# EasyEDA Pro project ProPrj_Space Mouse_2026-04-12.epro

# Schematic sensor_board
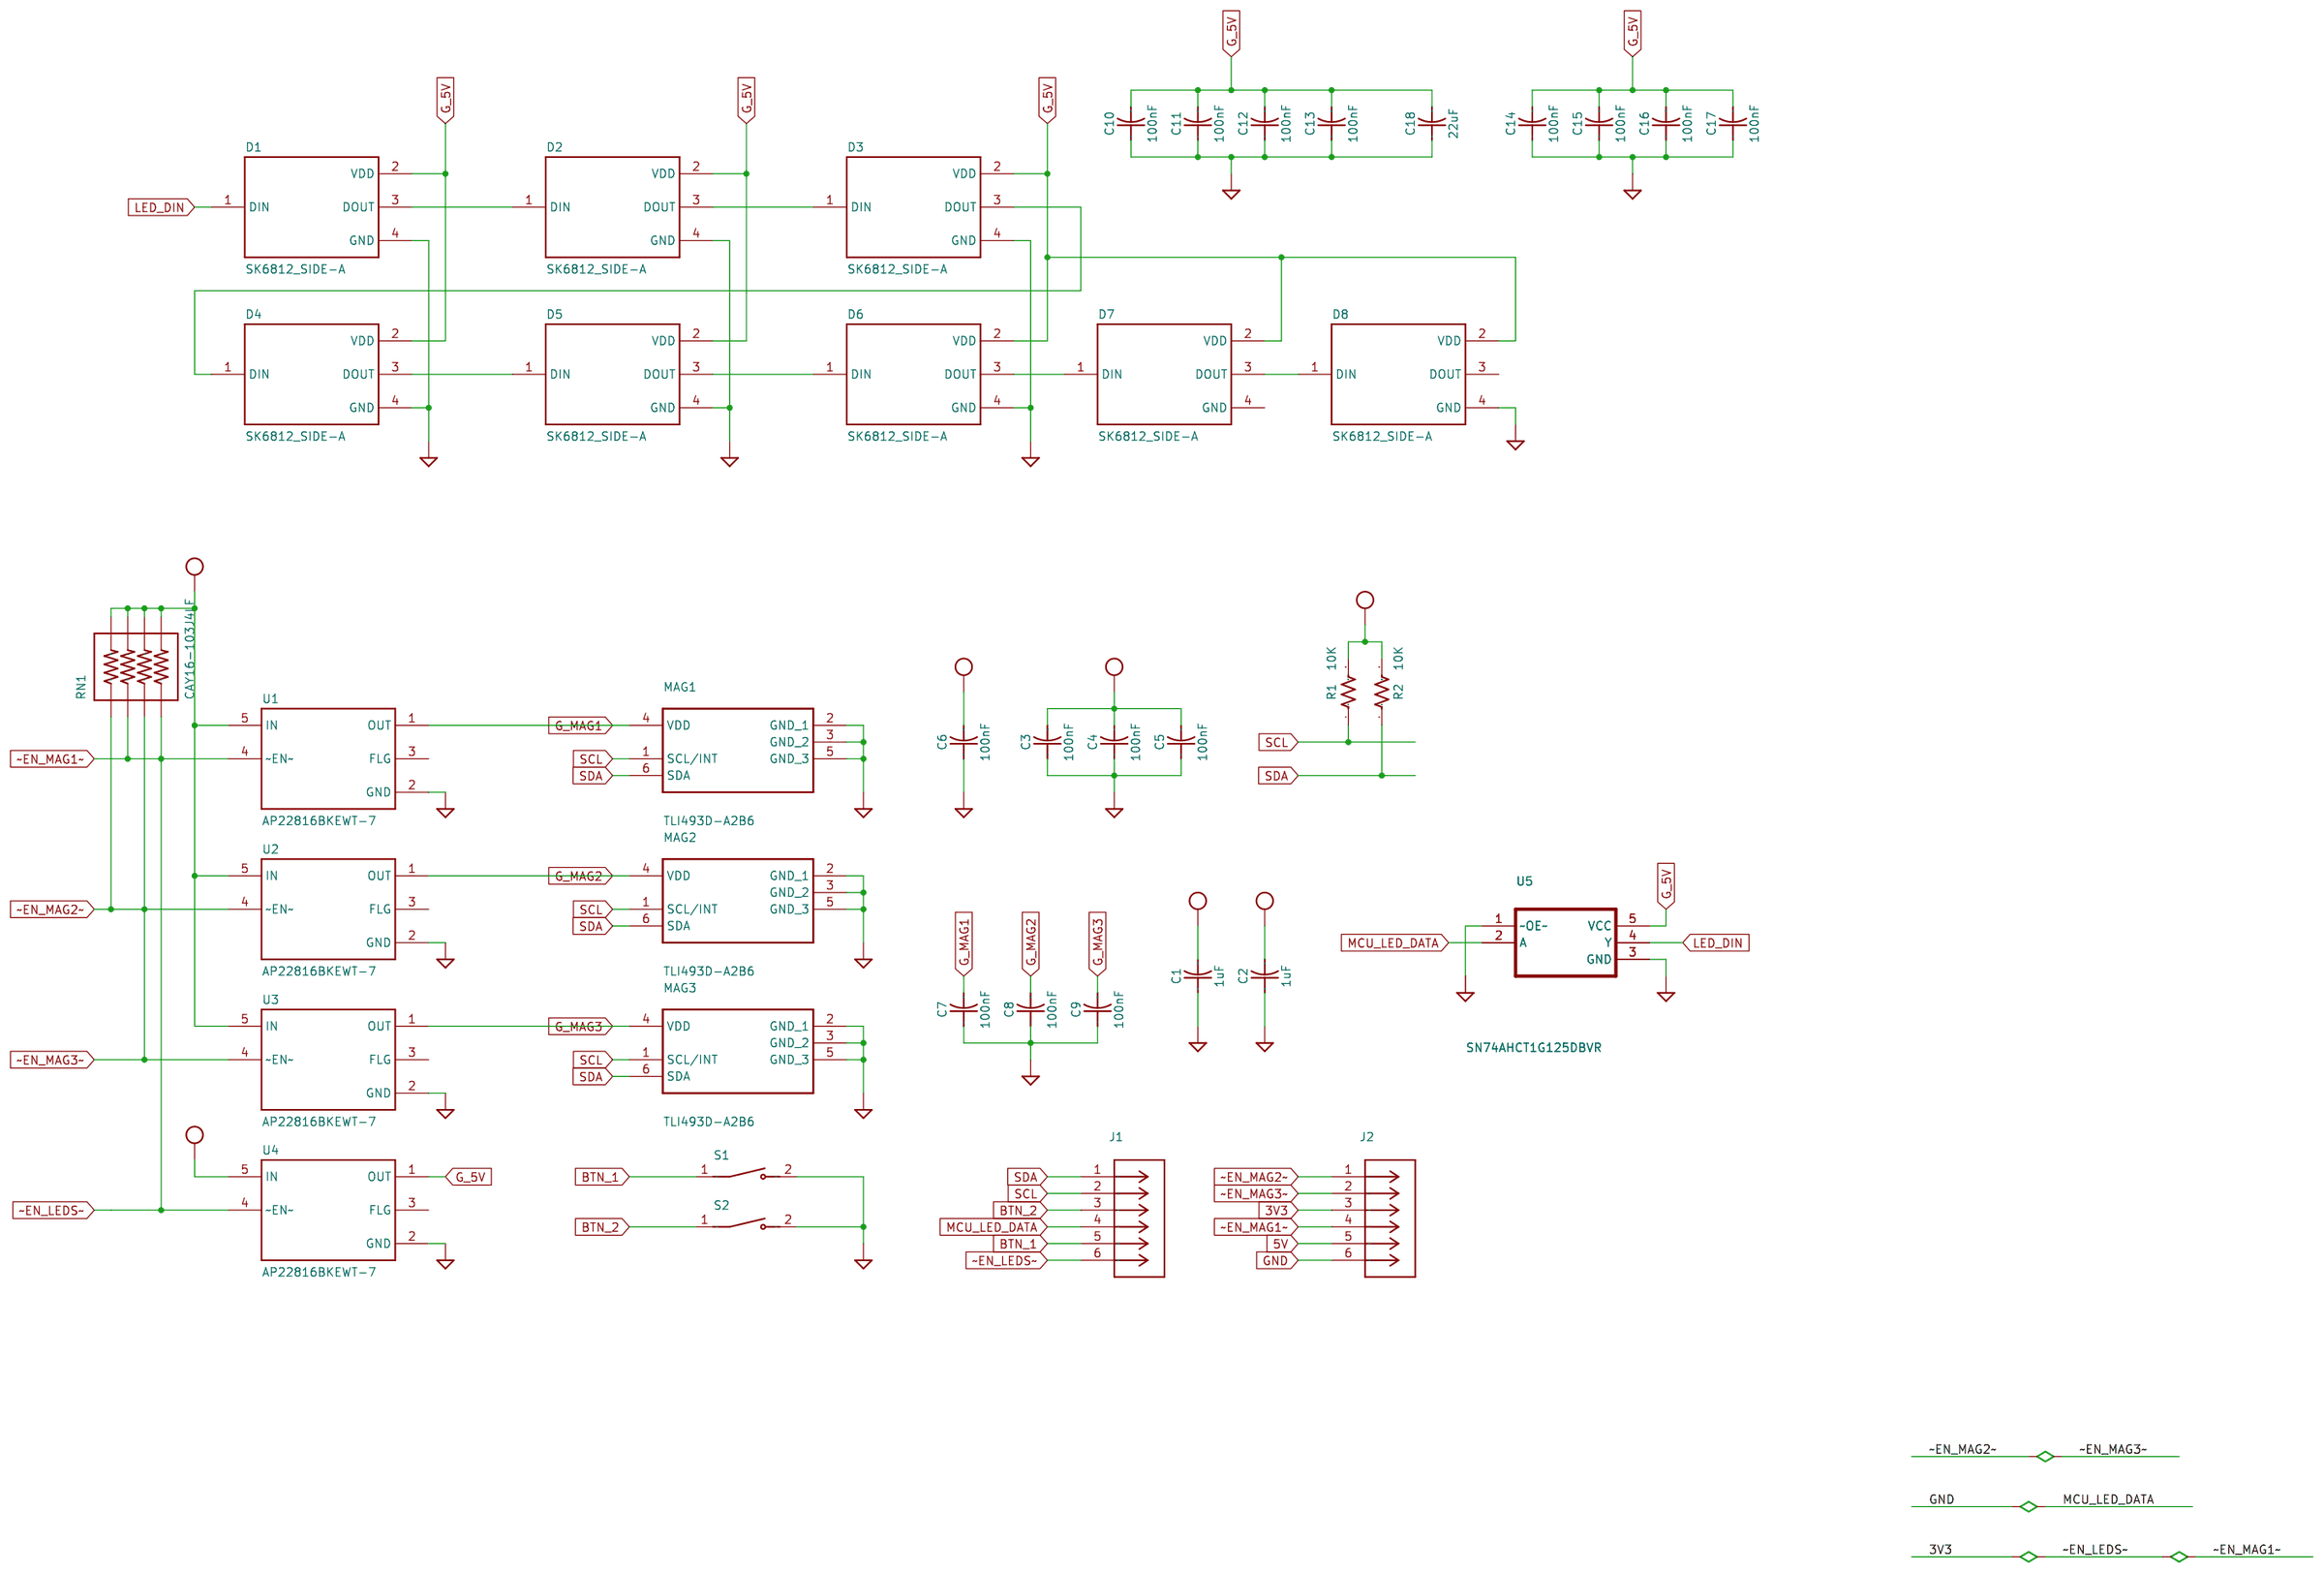
[diagram p0: schematic sheet]

## Parts
C1  1uF
C2  1uF
C3  100nF
C4  100nF
C5  100nF
C6  100nF
C7  100nF
C8  100nF
C9  100nF
C10  100nF
C11  100nF
C12  100nF
C13  100nF
C14  100nF
C15  100nF
C16  100nF
C17  100nF
C18  22uF
D1  SK6812_SIDE-A
D2  SK6812_SIDE-A
D3  SK6812_SIDE-A
D4  SK6812_SIDE-A
D5  SK6812_SIDE-A
D6  SK6812_SIDE-A
D7  SK6812_SIDE-A
D8  SK6812_SIDE-A
J1  NPPN032AFCN-RCCONN3X2_NPPN032AFCN-RC_SUL
J2  NPPN032AFCN-RCCONN3X2_NPPN032AFCN-RC_SUL
MAG1  TLI493D-A2B6
MAG2  TLI493D-A2B6
MAG3  TLI493D-A2B6
R1  10K
R2  10K
RN1  CAY16-103J4LF
S1  TS32-7-35-BK-160-RA-SMT-TR
S2  TS32-7-35-BK-160-RA-SMT-TR
U1  AP22816BKEWT-7
U2  AP22816BKEWT-7
U3  AP22816BKEWT-7
U4  AP22816BKEWT-7
U5  SN74AHCT1G125DBVR

## Library data of the parts
C1 C2 C18 = Capacitor_C-US_CHIP-1206(3216-METRIC)
C3-C17 = Capacitor_C-US_CHIP-0805(2012-METRIC)
D1-D8 = SK6812_SIDE-A_SK6812_SIDE-A_
J1 J2 = NPPN032AFCN-RC_NPPN032AFCN-RC_CONN3X2_NPPN032AFCN-RC_SUL
MAG1-MAG3 = TLI493D-A2B6_TLI493D-A2B6_
R1 R2 = Resistor_R-US_CHIP-0805(2012-METRIC)
RN1 = CAY16-103J4LF_CAY16-103J4LF_
S1 S2 = TS32-7-35-BK-160-RA-SMT-TR_TS32-7-35-BK-160-RA-SMT-TR_
U1-U4 = AP22816BKEWT-7_AP22816BKEWT-7_
U5 = SN74AHCT1G125DBVR_SN74AHCT1G125DBVR_

## Nets
3V3: C1.2 C3.2 C4.2 C5.2 J1.6 J2.3 J2.4 R1.2 R2.2 RN1.2 RN1.4 RN1.5 RN1.6 RN1.7 RN1.8 U1.4(~EN~) U1.5(IN) U2.5(IN) U3.5(IN) U4.4(~EN~)
5V: C2.2 C6.2 J2.5 U4.5(IN)
GND: C1.1 C2.1 C3.1 C4.1 C5.1 C6.1 C7.1 C8.1 C9.1 C10.1 C11.1 C12.1 C13.1 C14.1 C15.1 C16.1 C17.1 C18.1 D1.4(GND) D2.4(GND) D3.4(GND) D4.4(GND) D5.4(GND) D6.4(GND) D8.4(GND) J1.4 J2.6 MAG1.2(GND_1) MAG1.3(GND_2) MAG1.5(GND_3) MAG2.2(GND_1) MAG2.3(GND_2) MAG2.5(GND_3) MAG3.2(GND_1) MAG3.3(GND_2) MAG3.5(GND_3) S1.2 S2.2 U1.2(GND) U2.2(GND) U3.2(GND) U4.2(GND) U5.1(~OE~) U5.2(A) U5.3(GND)
BTN_1: J1.5 S1.1
BTN_2: J1.3 S2.1
G_5V: C10.2 C11.2 C12.2 C13.2 C14.2 C15.2 C16.2 C17.2 C18.2 D1.2(VDD) D2.2(VDD) D3.2(VDD) D4.2(VDD) D5.2(VDD) D6.2(VDD) D7.2(VDD) D8.2(VDD) U4.1(OUT) U5.5(VCC)
G_MAG1: C7.2 MAG1.4(VDD) U1.1(OUT)
G_MAG2: C8.2 MAG2.4(VDD) U2.1(OUT)
G_MAG3: C9.2 MAG3.4(VDD) U3.1(OUT)
LED_DIN: D1.1(DIN) U5.4(Y)
N$1: D1.3(DOUT) D2.1(DIN)
N$2: D2.3(DOUT) D3.1(DIN)
N$3: D6.3(DOUT) D7.1(DIN)
N$4: D3.3(DOUT) D4.1(DIN)
N$5: D4.3(DOUT) D5.1(DIN)
N$6: D5.3(DOUT) D6.1(DIN)
N$7: D7.3(DOUT) D8.1(DIN)
SCL: J1.2 MAG1.1(SCL/INT) MAG2.1(SCL/INT) MAG3.1(SCL/INT) R1.1
SDA: J1.1 MAG1.6(SDA) MAG2.6(SDA) MAG3.6(SDA) R2.1
~EN_MAG2~: J2.1 J2.2 RN1.1 RN1.3 U2.4(~EN~) U3.4(~EN~)

Not connected (* = marked no-connect by the designer): D7 4(GND); D8 3(DOUT); U1 3(FLG); U2 3(FLG); U3 3(FLG); U4 3(FLG)

# Board sensor_board
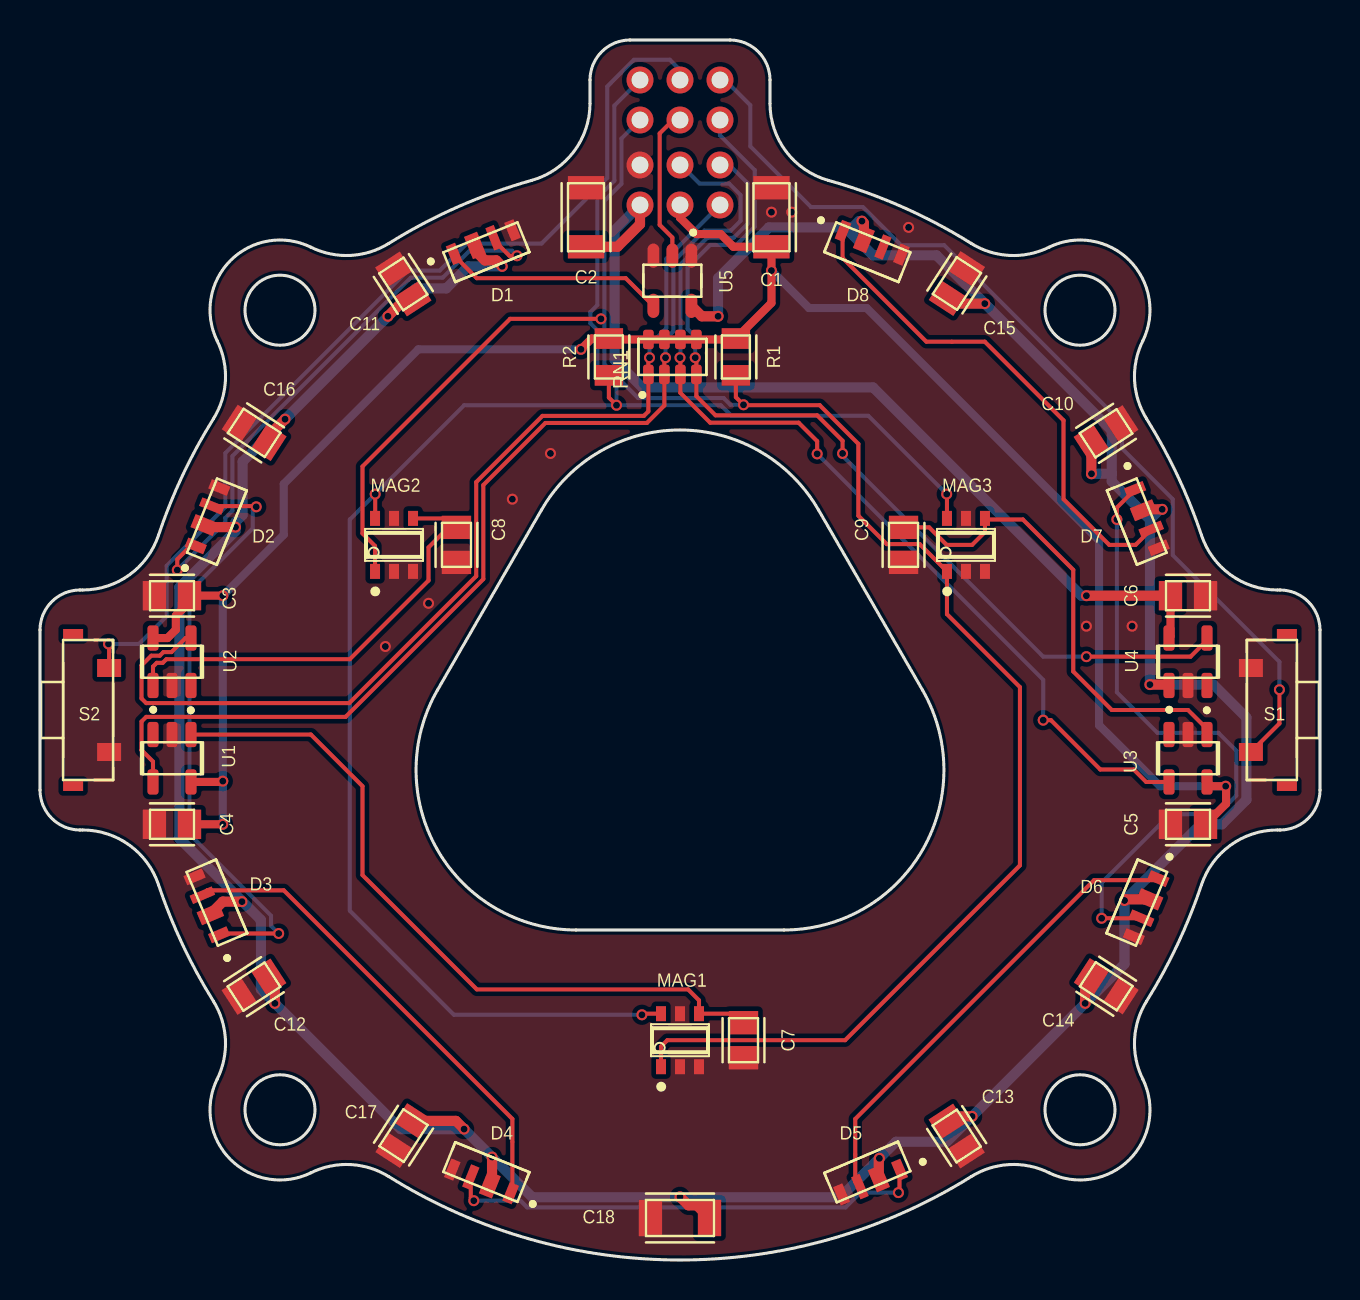
[diagram p1: board, top side]
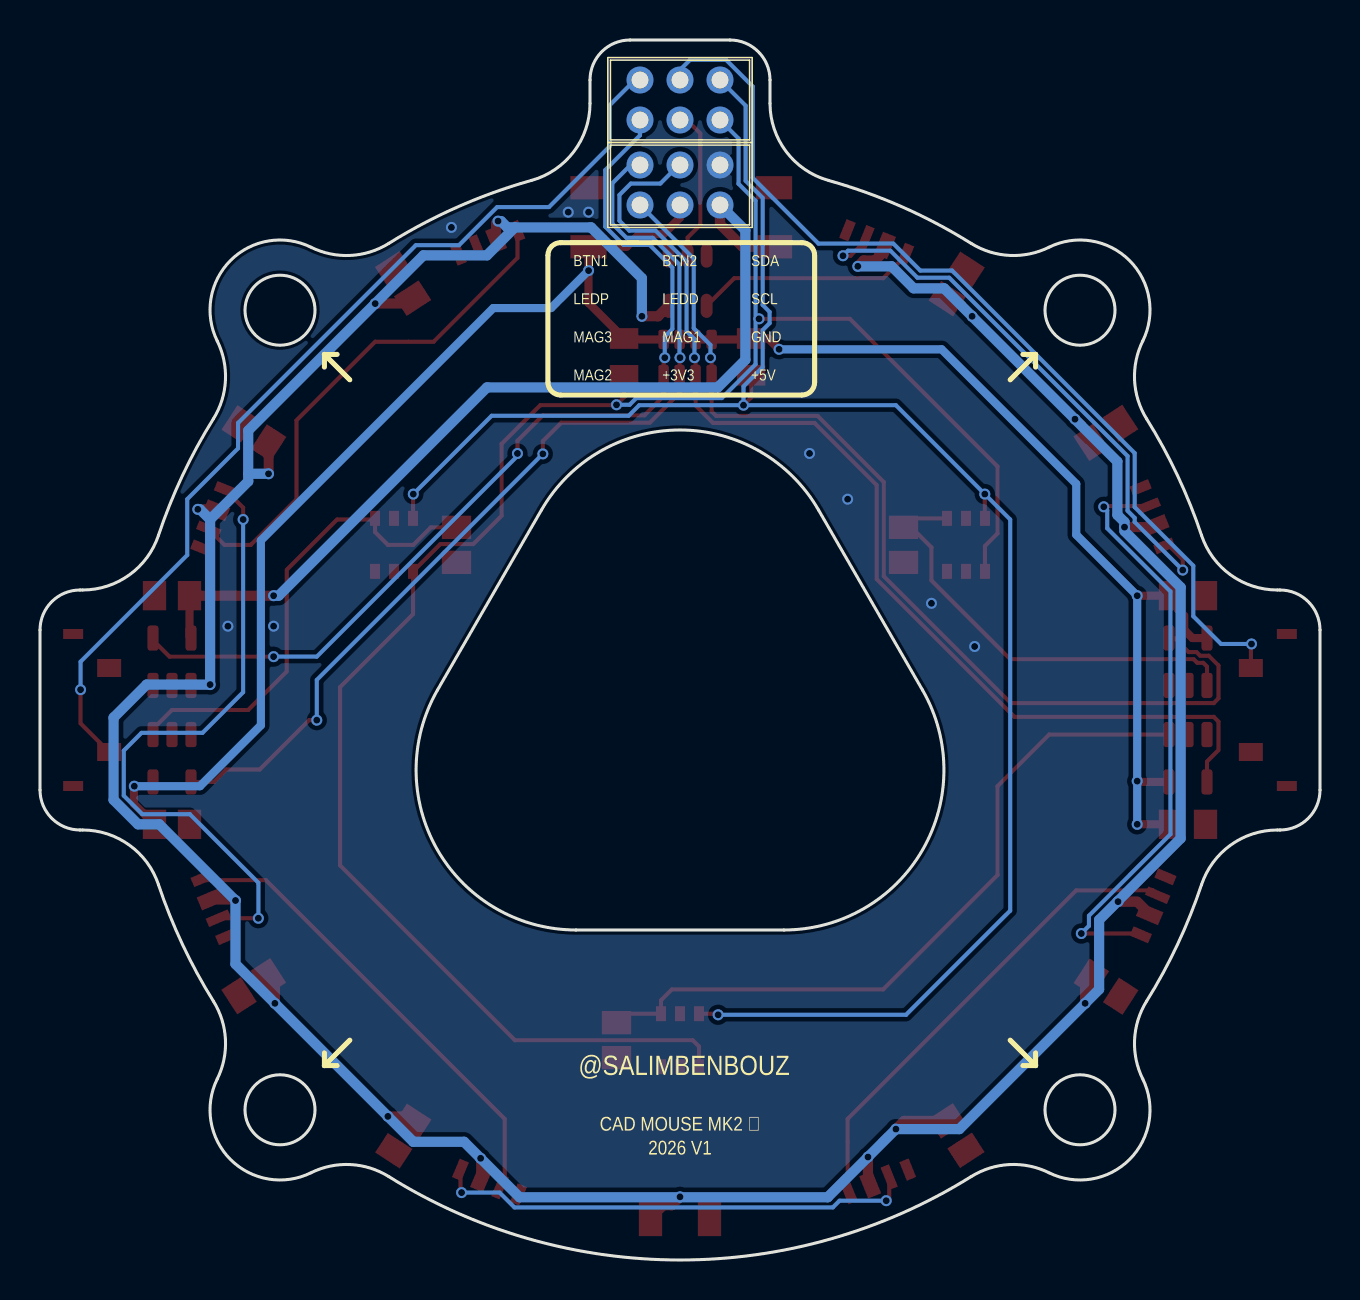
[diagram p2: board, bottom side, seen from below]

Outline 64 x 61 mm; copper layers: Top Layer, Bottom Layer. Coordinates in mm from the lower left corner of the outline.
Outline path: circle c12,47.49 r1.75 ; circle c12,7.51 r1.75 ; circle c52,47.49 r1.75 ; circle c52,7.51 r1.75 ; 0,31.5 arc(0.59,32.91) 2,33.5 2.13,33.5 arc(4.47,34.25) 5.92,36.23 arc(7.12,39.23) 8.67,42.06 arc(9.27,43.98) 8.86,45.95 arc(9.53,49.97) 13.55,50.64 arc(15.52,50.23) 17.44,50.83 arc(20.9,52.66) 24.58,53.98 arc(26.69,55.41) 27.5,57.83 27.5,59 arc(28.09,60.41) 29.5,61 34.5,61 arc(35.91,60.41) 36.5,59 36.5,57.83 arc(37.31,55.41) 39.42,53.98 arc(43.1,52.66) 46.56,50.83 arc(48.48,50.23) 50.45,50.64 arc(54.47,49.97) 55.14,45.95 arc(54.73,43.98) 55.33,42.06 arc(56.88,39.23) 58.08,36.23 arc(59.53,34.25) 61.87,33.5 62,33.5 arc(63.41,32.91) 64,31.5 64,23.5 arc(63.41,22.09) 62,21.5 61.87,21.5 arc(59.53,20.75) 58.08,18.77 arc(56.88,15.77) 55.33,12.94 arc(54.73,11.02) 55.14,9.05 arc(54.47,5.03) 50.45,4.36 arc(48.48,4.77) 46.56,4.17 arc(32,0) 17.44,4.17 arc(15.52,4.77) 13.55,4.36 arc(9.53,5.03) 8.86,9.05 arc(9.27,11.02) 8.67,12.94 arc(7.12,15.77) 5.92,18.77 arc(4.47,20.75) 2.13,21.5 2,21.5 arc(0.59,22.09) 0,23.5 0,31.5 ; 19.88,28.5 25.07,37.5 arc(32,41.5) 38.93,37.5 44.12,28.5 arc(44.12,20.5) 37.2,16.5 26.8,16.5 arc(19.88,20.5) 19.88,28.5
Stack: Top Layer 0.035mm / Dielectric1 1.51mm FR4 er 4.5 / Bottom Layer 0.035mm

## Design rules (mm)
spacing safeClearance (default): track to track 0.152, other pairs 0 to 0.3
track width trackWidth: min 0.152, default 0.152, max 2.54
track width default (default): min 0.003, default 0.003, max 2.54
differential pair differentialPair (default): width min 0.127, default 0.254, max 2.54; gap min 0.152, default 0.152
via viaSize: diameter min 0.3, default 0.3, max 2.6; hole min 0.3, default 0.3, max 2
via default (default): diameter min 0, default 0, max 2.6; hole min 0, default 0, max 2
net GND uses CopperRegion1
pour ie1 uses CopperRegion
pour ie2 uses CopperRegion1

## Placement (name value [footprint] x y rotation side)
C1  1uF  [CAPC3216X135]  36.57 52.14 270 top
C2  1uF  [CAPC3216X135]  27.3 52.14 270 top
C3  100nF  [CAPC2012X110]  6.6 33.22 0 top
C4  100nF  [CAPC2012X110]  6.6 21.79 0 top
C5  100nF  [CAPC2012X110]  57.4 21.79 0 top
C6  100nF  [CAPC2012X110]  57.4 33.22 180 top
C7  100nF  [CAPC2012X110]  35.18 10.99 90 top
C8  100nF  [CAPC2012X110]  20.82 35.76 90 top
C9  100nF  [CAPC2012X110]  43.18 35.76 90 top
C10  100nF  [CAPC2012X110]  53.3 41.33 213 top
C11  100nF  [CAPC2012X110]  18.17 48.8 303 top
C12  100nF  [CAPC2012X110]  10.7 13.67 33 top
C13  100nF  [CAPC2012X110]  45.83 6.2 123 top
C14  100nF  [CAPC2012X110]  53.31 13.69 147 top
C15  100nF  [CAPC2012X110]  45.84 48.82 237 top
C16  100nF  [CAPC2012X110]  10.71 41.36 327 top
C17  100nF  [CAPC2012X110]  18.18 6.22 57 top
C18  22uF  [CAPC3216X135]  32 2.1 0 top
D1  SK6812_SIDE-A  [LED_SK6812_SIDE-A]  22.32 50.39 22 top
D2  SK6812_SIDE-A  [LED_SK6812_SIDE-A]  8.84 36.92 68 top
D3  SK6812_SIDE-A  [LED_SK6812_SIDE-A]  8.84 17.87 113 top
D4  SK6812_SIDE-A  [LED_SK6812_SIDE-A]  22.32 4.4 158 top
D5  SK6812_SIDE-A  [LED_SK6812_SIDE-A]  41.37 4.4 203 top
D6  SK6812_SIDE-A  [LED_SK6812_SIDE-A]  54.84 17.87 247 top
D7  SK6812_SIDE-A  [LED_SK6812_SIDE-A]  54.84 36.92 292 top
D8  SK6812_SIDE-A  [LED_SK6812_SIDE-A]  41.37 50.39 338 top
J1  NPPN032AFCN-RCCONN3X2_NPPN032AFCN-RC_SUL  [CONN3X2_NPPN032AFCN-RC_SUL]  32 58 180 bottom
J2  NPPN032AFCN-RCCONN3X2_NPPN032AFCN-RC_SUL  [CONN3X2_NPPN032AFCN-RC_SUL]  32 53.75 0 bottom
MAG1  TLI493D-A2B6  [SOP95P280X110-6N-V]  32 10.99 90 top
MAG2  TLI493D-A2B6  [SOP95P280X110-6N-V]  17.7 35.76 90 top
MAG3  TLI493D-A2B6  [SOP95P280X110-6N-V]  46.3 35.76 90 top
R1  10K  [RESC2012X65]  34.79 45.15 90 top
R2  10K  [RESC2012X65]  28.44 45.15 90 top
RN1  CAY16-103J4LF  [RESCAF80P320X160X60-8N]  31.62 45.15 90 top
S1  TS32-7-35-BK-160-RA-SMT-TR  [SW_TS32-7-35-BK-160-RA-SMT-TR]  61.84 27.5 90 top
S2  TS32-7-35-BK-160-RA-SMT-TR  [SW_TS32-7-35-BK-160-RA-SMT-TR]  2.16 27.5 270 top
U1  AP22816BKEWT-7  [SOT95P280X100-5N]  6.6 25.09 270 top
U2  AP22816BKEWT-7  [SOT95P280X100-5N]  6.6 29.91 90 top
U3  AP22816BKEWT-7  [SOT95P280X100-5N]  57.4 25.09 270 top
U4  AP22816BKEWT-7  [SOT95P280X100-5N]  57.4 29.91 90 top
U5  SN74AHCT1G125DBVR  [SOT95P280X145-5N]  31.62 48.96 270 top

## Footprints (pads in the part's own frame, mm; a bottom-side part is the same pattern mirrored in y, then rotated)
CAPC2012X110
  rect 1.165x1.466 smd: 1(-0.875,0) 2(0.875,0)
CAPC3216X135
  rect 1.165x1.815 smd: 1(-1.476,0) 2(1.476,0)
CONN3X2_NPPN032AFCN-RC_SUL
  round 1.346 hole 0.838: 1(2,1) 2(2,-1) 3(0,1) 4(0,-1) 5(-2,1) 6(-2,-1)
LED_SK6812_SIDE-A
  rect 0.5x1 smd: 1(-1.525,0.525) 4(1.625,0.525)
  rect 0.7x1.2 smd: 2(-0.4,0.525)
  rect 0.45x1.2 smd: 3(0.625,0.525)
RESC2012X65
  rect 1.031x1.42 smd: 1(-0.919,0) 2(0.919,0)
RESCAF80P320X160X60-8N
  rrect 0.97x0.53 smd: 1(-0.875,1.2) 2(-0.875,0.4) 3(-0.875,-0.4) 4(-0.875,-1.2) 5(0.875,-1.2) 6(0.875,-0.4) 7(0.875,0.4) 8(0.875,1.2)
SOP95P280X110-6N-V
  rect 0.75x0.5 smd: 1(-1.325,0.95) 2(-1.325,0) 3(-1.325,-0.95) 4(1.325,-0.95) 5(1.325,0) 6(1.325,0.95)
SOT95P280X100-5N
  rrect 1.26x0.55 smd: 1(-1.185,0.95) 2(-1.185,0) 3(-1.185,-0.95) 4(1.185,-0.95) 5(1.185,0.95)
SOT95P280X145-5N
  rrect 1.21x0.59 smd: 1(-1.255,0.95) 2(-1.255,0) 3(-1.255,-0.95) 4(1.255,-0.95) 5(1.255,0.95)
SW_TS32-7-35-BK-160-RA-SMT-TR
  rect 0.9x1.2 smd: 1(-2.1,1.3) 2(2.1,1.3)
  rect 0.5x1 smd: SH1(-3.8,-0.5) SH2(3.8,-0.5)

## Nets
3V3: C1.2 C3.2 C4.2 C5.2 J2.3 R1.2 R2.2 RN1.5 RN1.6 RN1.7 RN1.8 U1.5 U2.5 U3.5
5V: C2.2 C6.2 J2.5 U4.5
GND: C1.1 C2.1 C3.1 C4.1 C5.1 C6.1 C7.1 C8.1 C9.1 C10.1 C11.1 C12.1 C13.1 C14.1 C15.1 C16.1 C17.1 C18.1 D1.4 D2.4 D3.4 D4.4 D5.4 D6.4 D7.4 D8.4 J2.6 MAG1.2 MAG1.3 MAG1.5 MAG2.2 MAG2.3 MAG2.5 MAG3.2 MAG3.3 MAG3.5 S1.2 S2.2 U1.2 U2.2 U3.2 U4.2 U5.1 U5.3
!EN_LEDS: J1.6 RN1.4 U4.4
!EN_MAG1: J2.4 RN1.2 U1.4
!EN_MAG2: J2.1 RN1.1 U2.4
!EN_MAG3: J2.2 RN1.3 U3.4
BTN_1: J1.5 S1.1
BTN_2: J1.3 S2.1
G_5V: C10.2 C11.2 C12.2 C13.2 C14.2 C15.2 C16.2 C17.2 C18.2 D1.2 D2.2 D3.2 D4.2 D5.2 D6.2 D7.2 D8.2 U4.1 U5.5
G_MAG1: C7.2 MAG1.4 U1.1
G_MAG2: C8.2 MAG2.4 U2.1
G_MAG3: C9.2 MAG3.4 U3.1
LED_DIN: D1.1 U5.4
MCU_LED_DATA: J1.4 U5.2
N$1: D1.3 D2.1
N$2: D2.3 D3.1
N$3: D6.3 D7.1
N$4: D3.3 D4.1
N$5: D4.3 D5.1
N$6: D5.3 D6.1
N$7: D7.3 D8.1
SCL: J1.2 MAG1.1 MAG2.1 MAG3.1 R1.1
SDA: J1.1 MAG1.6 MAG2.6 MAG3.6 R2.1

Pads without a net: D8 3; S1 SH1 SH2; S2 SH1 SH2; U1 3; U2 3; U3 3; U4 3

## Via types
v1: diameter 0.55, hole 0.35, Top Layer to Bottom Layer, 59 vias

## Routing (per net, layer and track width the routed paths; a pad name or vN(x,y) marks a point on that pad's centre or on a via; arc(x,y) is an arc through that point)
3V3: length 105.5
  Top Layer w0.406: J2.3 32,52.12 32.82,51.3 34.03,51.3 34.67,50.66 C1.2 v1(36.57,49.47) 36.57,47.85 R1.2 34.75,46.03 RN1.5 RN1.6 RN1.7 RN1.8 28.49,46.03 R2.2 27.59,46.07 v1(27.05,45.53) ; 59.31,23.69 58.56,23.69 U3.5 ; 59.31,23.69 59.31,22.81 C5.2 ; 59.31,23.69 v1(59.28,23.69) ; U2.5 6.38,31.1 6.79,31.51 6.79,32.22 7.09,32.52 7.09,32.83 C3.2 v1(9.14,33.22) ; U1.5 9.1,23.9 v1(9.14,23.94) ; v1(9.14,21.79) C4.2
  Bottom Layer w0.406: v1(27.05,45.53) 18.92,45.53 12.19,38.8 12.19,36.26 v1(9.14,33.22) v1(9.14,23.94) v1(9.14,21.79) ; v1(36.57,49.47) 38.45,47.6 41.33,47.6 52.96,35.98 52.96,26.74 56,23.69 v1(59.28,23.69)
5V: length 47.2
  Top Layer w0.406: C6.2 56.52,31.17 U4.5
  Top Layer w0.508: C2.2 28.87,50.66 30,51.79 J2.5 ; C6.2 v1(52.32,33.22)
  Bottom Layer w0.508: J2.5 28.73,51.48 28.73,45.01 30.11,43.63 41.65,43.63 52.07,33.22 v1(52.32,33.22)
GND:
  vias: v1(17.27,30.68) v1(19.43,32.83) v1(23.62,38.04) v1(25.52,40.33) v1(36.57,52.39) v1(37.59,52.39) v1(43.43,51.63) v1(52.32,31.69) v1(54.61,31.69)
!EN_LEDS: length 48.7
  Top Layer w0.203: v1(32.76,45.12) 32.82,45.06 RN1.4 32.82,43.19 33.78,42.23 38.86,42.23 40.13,40.96 v1(40.13,40.33) ; U4.4 58.35,30.99 57.53,30.17 v1(52.32,30.17)
  Bottom Layer w0.203: v1(40.13,40.33) 40.13,40.2 50.16,30.17 v1(52.32,30.17) ; v1(32.76,45.12) 32.76,46.17 32.38,46.55 32.38,49.62 33.51,50.76 34.83,50.76 35.74,51.67 35.74,54.49 34,56.23 J1.6
!EN_MAG1: length 55.2
  Top Layer w0.203: U1.4 5.65,24.92 5.08,25.5 5.08,26.92 5.31,27.16 15.28,27.16 22.17,34.05 22.17,38.75 25.27,41.85 30.34,41.85 31.22,42.73 RN1.2 31.22,45.06 v1(31.28,45.12)
  Bottom Layer w0.203: v1(31.28,45.12) 31.28,46.05 31.67,46.44 31.67,49.92 33.22,51.47 34.53,51.47 35.03,51.96 35.03,53.25 34.46,53.82 32.98,53.82 32.05,54.75 J2.4
!EN_MAG2: length 50.7
  Top Layer w0.203: v1(30.48,45.12) 30.42,45.06 RN1.1 30.42,42.43 30.2,42.21 25.12,42.21 21.81,38.9 21.81,34.19 15.46,27.84 5.31,27.84 5.08,28.08 5.08,29.73 5.56,30.21 5.99,30.21 6.17,30.4 6.57,30.4 7.28,31.1 U2.4
  Bottom Layer w0.203: J2.1 31.31,50.07 31.31,46.59 30.48,45.75 v1(30.48,45.12)
!EN_MAG3: length 48.5
  Top Layer w0.203: v1(32,45.12) 32.02,45.1 RN1.3 32.02,43.36 33.51,41.86 37.93,41.86 38.86,40.94 v1(38.86,40.31) ; U3.4 55.31,23.9 54.68,24.52 53.01,24.52 50.55,26.99 v1(50.16,26.99)
  Bottom Layer w0.203: v1(38.86,40.31) 50.16,29 v1(50.16,26.99) ; J2.2 34.47,54.75 35.38,53.83 35.38,51.82 34.68,51.11 33.37,51.11 32.03,49.77 32.03,45.27 32,45.24 v1(32,45.12)
BTN_1: length 48.7
  Top Layer w0.203: v1(61.97,28.52) 61.97,26.83 S1.1
  Bottom Layer w0.203: J1.5 34.25,59 35.51,57.74 35.51,55.69 38.55,52.65 41.14,52.65 43.05,50.74 45.21,50.74 54.1,41.85 54.1,40.58 56.64,38.04 56.64,35.25 61.97,29.91 v1(61.97,28.52)
BTN_2: length 48.3
  Top Layer w0.203: S2.1 3.45,30.77 v1(3.42,30.8)
  Bottom Layer w0.203: v1(3.42,30.8) 4.95,30.8 6.34,32.19 6.34,34.71 9.27,37.65 9.27,40.35 18.39,49.47 19.98,49.47 21.33,50.82 25.08,50.82 28.36,54.11 28.36,58.67 29.7,60.01 31.49,60.01 32,59.5 J1.3
G_5V: length 192
  Top Layer w0.508: v1(32,3.16) 32.42,2.74 32.84,2.74 C18.2 ; D5.2 41.94,5.06 v1(41.97,5.08) ; v1(47.24,47.82) 45.64,47.82 C15.2 ; v1(22.6,5.15) 22.6,3.87 22.49,3.76 ; v1(55.5,28.77) 56.41,28.77 U4.1 ; 52.57,40.86 52.57,39.32 v1(52.57,39.31) ; v1(23.11,49.68) 22.81,49.98 22.25,49.98 21.75,50.48 D1.2 ; v1(9.78,36.64) 8.31,36.64 D2.2 ; C16.2 11.44,41.23 v1(12.25,42.04) ; v1(54.22,17.98) 54.28,18.03 D6.2 ; D7.2 55.22,37.53 v1(56.11,37.53) ; 11.43,14.14 11.74,13.83 v1(11.74,12.83) ; v1(46.6,7.18) 45.6,7.18 45.36,6.93 ; C14.2 52.26,13.84 v1(52.26,12.83) ; v1(41.1,51.94) 41.19,51.85 D8.2 ; U5.5 33.09,47.19 v1(33.91,47.19) ; C17.2 20.8,6.95 v1(21.21,6.55) ; v1(10.1,17.92) 9.14,17.92 D3.2 ; 18.64,48.07 18.28,48.07 v1(17.4,47.19)
  Bottom Layer w0.508: 55.5,37.03 56,37.53 v1(56.11,37.53) ; 55.5,37.03 v1(55.5,28.77) 58.67,28.77 60.32,27.12 60.32,23.01 59.1,21.79 58.03,21.79 v1(54.22,17.98) 54.22,14.8 v1(52.26,12.83) v1(46.6,7.18) 45.34,5.91 42.79,5.91 v1(41.97,5.08) 40.02,3.14 32,3.14 ; 55.5,37.03 53.59,38.93 53.59,39.31 ; v1(33.91,47.19) 33.91,49.09 36.44,51.63 40.25,51.63 ; 32,3.14 v1(32,3.16) ; 32,3.14 24.61,3.14 v1(22.6,5.15) v1(21.21,6.55) 18.03,6.55 v1(11.74,12.83) 11.04,13.53 11.04,17 10.11,17.93 ; 40.25,51.63 41.65,50.23 44.83,50.23 v1(47.24,47.82) 53.59,41.47 53.59,39.31 ; 40.25,51.63 40.64,51.63 40.95,51.94 v1(41.1,51.94) ; 10.11,17.93 v1(10.1,17.92) ; 10.11,17.93 6.97,21.08 6.97,33.64 9.78,36.44 v1(9.78,36.64) 9.78,36.9 10.13,37.25 10.13,39.92 v1(12.25,42.04) v1(17.4,47.19) 18.79,48.58 20.32,48.58 21.42,49.68 v1(23.11,49.68) ; v1(52.57,39.31) 53.59,39.31
G_MAG1: length 36.6
  Top Layer w0.203: U1.1 13.54,26.27 16.12,23.69 16.12,19.25 21.84,13.53 32.4,13.53 32.95,12.98 MAG1.4 34.73,12.32 C7.2
G_MAG2: length 22.3
  Top Layer w0.203: MAG2.4 20.37,37.08 C8.2 20.43,36.63 19.43,35.63 19.43,33.98 15.49,30.04 6.32,30.04 6.14,29.86 5.84,29.86 5.65,29.67 U2.1
G_MAG3: length 24.1
  Top Layer w0.203: C9.2 44.46,36.63 45.34,35.76 46.6,35.76 47.25,36.4 MAG3.4 47.3,37.03 49.15,37.03 51.66,34.51 51.66,29.43 53.59,27.5 57.4,27.5 58.35,26.55 U3.1
LED_DIN: length 11.1
  Top Layer w0.203: D1.1 20.71,50.22 21.84,49.09 29.29,49.09 U5.4
MCU_LED_DATA: length 7.7
  Top Layer w0.203: J1.4 31.66,57 30.98,56.33 30.98,51.76 31.62,51.12 U5.2
N$1: length 28.8
  Top Layer w0.203: 7.79,35.7 7.53,35.7 6.86,35.03 v1(6.86,34.5) ; v1(23.85,50.21) 23.47,50.21 22.7,50.98 D1.3
  Bottom Layer w0.203: v1(6.86,34.5) 9.27,36.9 9.27,37.11 9.62,37.46 9.62,40.2 18.54,49.12 20.13,49.12 21.48,50.47 23.6,50.47 v1(23.85,50.21)
N$2: length 29.8
  Top Layer w0.203: D2.3 10.75,37.7 10.79,37.66 v1(10.81,37.66) ; D3.1 9.02,16.32 v1(11.93,16.32)
  Bottom Layer w0.203: v1(10.81,37.66) 10.64,37.49 10.64,36.59 7.48,33.42 7.48,21.29 11.55,17.21 11.55,16.71 v1(11.93,16.32)
N$3: length 32.3
  Top Layer w0.203: D6.3 53.08,17.09 v1(53.08,17.09) ; 54.75,38.53 53.84,37.62 v1(53.84,37.03)
  Bottom Layer w0.203: v1(53.08,17.09) 53.08,18.86 56.51,22.29 58.89,22.29 59.81,23.22 59.81,25.47 58.92,26.36 55.88,26.36 53.84,28.39 v1(53.84,37.03)
N$4: length 24.1
  Top Layer w0.203: D3.3 8.36,18.48 12.19,18.48 23.62,7.05 23.62,3.42 D4.1
N$5: length 24.1
  Top Layer w0.203: D4.3 21.52,4.13 21.54,4.11 21.54,3.12 v1(21.69,2.97) ; D5.1 42.98,3.43 v1(42.92,3.37)
  Bottom Layer w0.203: v1(42.92,3.37) 41.02,3.37 40.28,2.63 24.36,2.63 24.02,2.97 v1(21.69,2.97)
N$6: length 23.6
  Top Layer w0.203: D5.3 40.76,3.91 40.76,7.05 52.7,18.99 55.84,18.99 D6.1
N$7: length 25.4
  Top Layer w0.203: D7.3 54.78,35.76 53.46,35.76 51.18,38.04 51.18,41.98 47.24,45.92 44.32,45.92 40.13,50.11 40.13,51.43 40.15,51.45
SCL: length 97.7
  Top Layer w0.203: MAG1.1 31.05,10.68 31.37,10.99 40.25,10.99 49,19.73 49,28.64 45.35,32.29 MAG3.1 43.98,35.79 42.34,35.79 40.92,37.21 40.92,40.81 38.99,42.74 35.18,42.74 v1(35.18,42.76) 34.79,43.14 R1.1 ; MAG2.1 16.75,35.7 16.12,36.33 16.12,39.68 23.5,47.06 v1(28.05,47.06)
  Bottom Layer w0.203: v1(35.18,42.76) 34.52,42.76 34.18,43.1 29.91,43.1 28.22,44.78 28.22,47.06 ; 28.22,47.06 v1(28.05,47.06) ; 28.22,47.06 28.22,52.96 29.07,53.81 29.07,56.07 J1.2
SDA: length 93.3
  Top Layer w0.203: MAG3.6 45.35,38.28 v1(45.34,38.3) ; v1(16.76,38.3) 16.76,37.09 MAG2.6 ; R2.1 28.44,43.12 v1(28.82,42.74) ; v1(30.09,12.26) 30.15,12.32 MAG1.6
  Bottom Layer w0.203: J1.1 28.72,57.72 28.72,53.96 27.87,53.11 27.87,47.75 27.52,47.4 27.52,46.84 27.87,46.49 27.87,44.64 28.82,43.68 v1(28.82,42.74) ; v1(28.82,42.74) 21.21,42.74 v1(16.76,38.3) 15.49,37.03 15.49,17.47 20.7,12.26 v1(30.09,12.26) ; v1(28.82,42.74) 34.04,42.74 34.57,42.21 41.42,42.21 v1(45.34,38.3)

## Copper pours and planes (outline as drawn; the poured copper is in the pictures)
GND on Top Layer: -2.85,-2.9 67.48,-2.9 67.48,62.98 -2.85,62.98
GND on Bottom Layer: -3.48,-3.54 68.12,-3.54 68.12,63.62 -3.48,63.62

## Text on the board
Bottom Silkscreen Layer: SDA | SCL | GND | +5V | BTN2 | LEDD | MAG1 | +3V3 | BTN1 | LEDP | MAG3 | MAG2 | CAD MOUSE MK2 / 2026 V1 | @SALIMBENBOUZ
